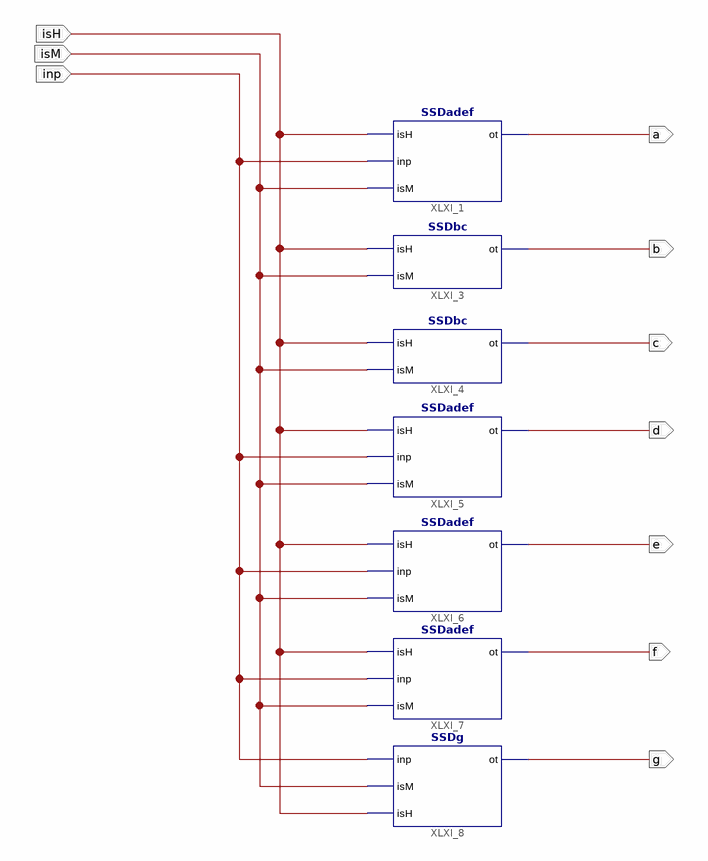
[diagram p0: schematic sheet 1]
// Xilinx ISE schematic SSD.sch (xc9500xl) as structural Verilog: 7 symbols, 10 ports
module SSD (
  input  inp,
  input  isM,
  input  isH,
  output a,
  output b,
  output c,
  output d,
  output e,
  output f,
  output g
);

  SSDadef XLXI_1 (.isH(isH), .inp(inp), .isM(isM), .ot(a));
  SSDbc XLXI_3 (.isH(isH), .isM(isM), .ot(b));
  SSDbc XLXI_4 (.isH(isH), .isM(isM), .ot(c));
  SSDadef XLXI_5 (.isH(isH), .inp(inp), .isM(isM), .ot(d));
  SSDadef XLXI_6 (.isH(isH), .inp(inp), .isM(isM), .ot(e));
  SSDadef XLXI_7 (.isH(isH), .inp(inp), .isM(isM), .ot(f));
  SSDg XLXI_8 (.inp(inp), .isM(isM), .isH(isH), .ot(g));
endmodule
